# EAGLE design schematic (EAGLE 6.5.0)
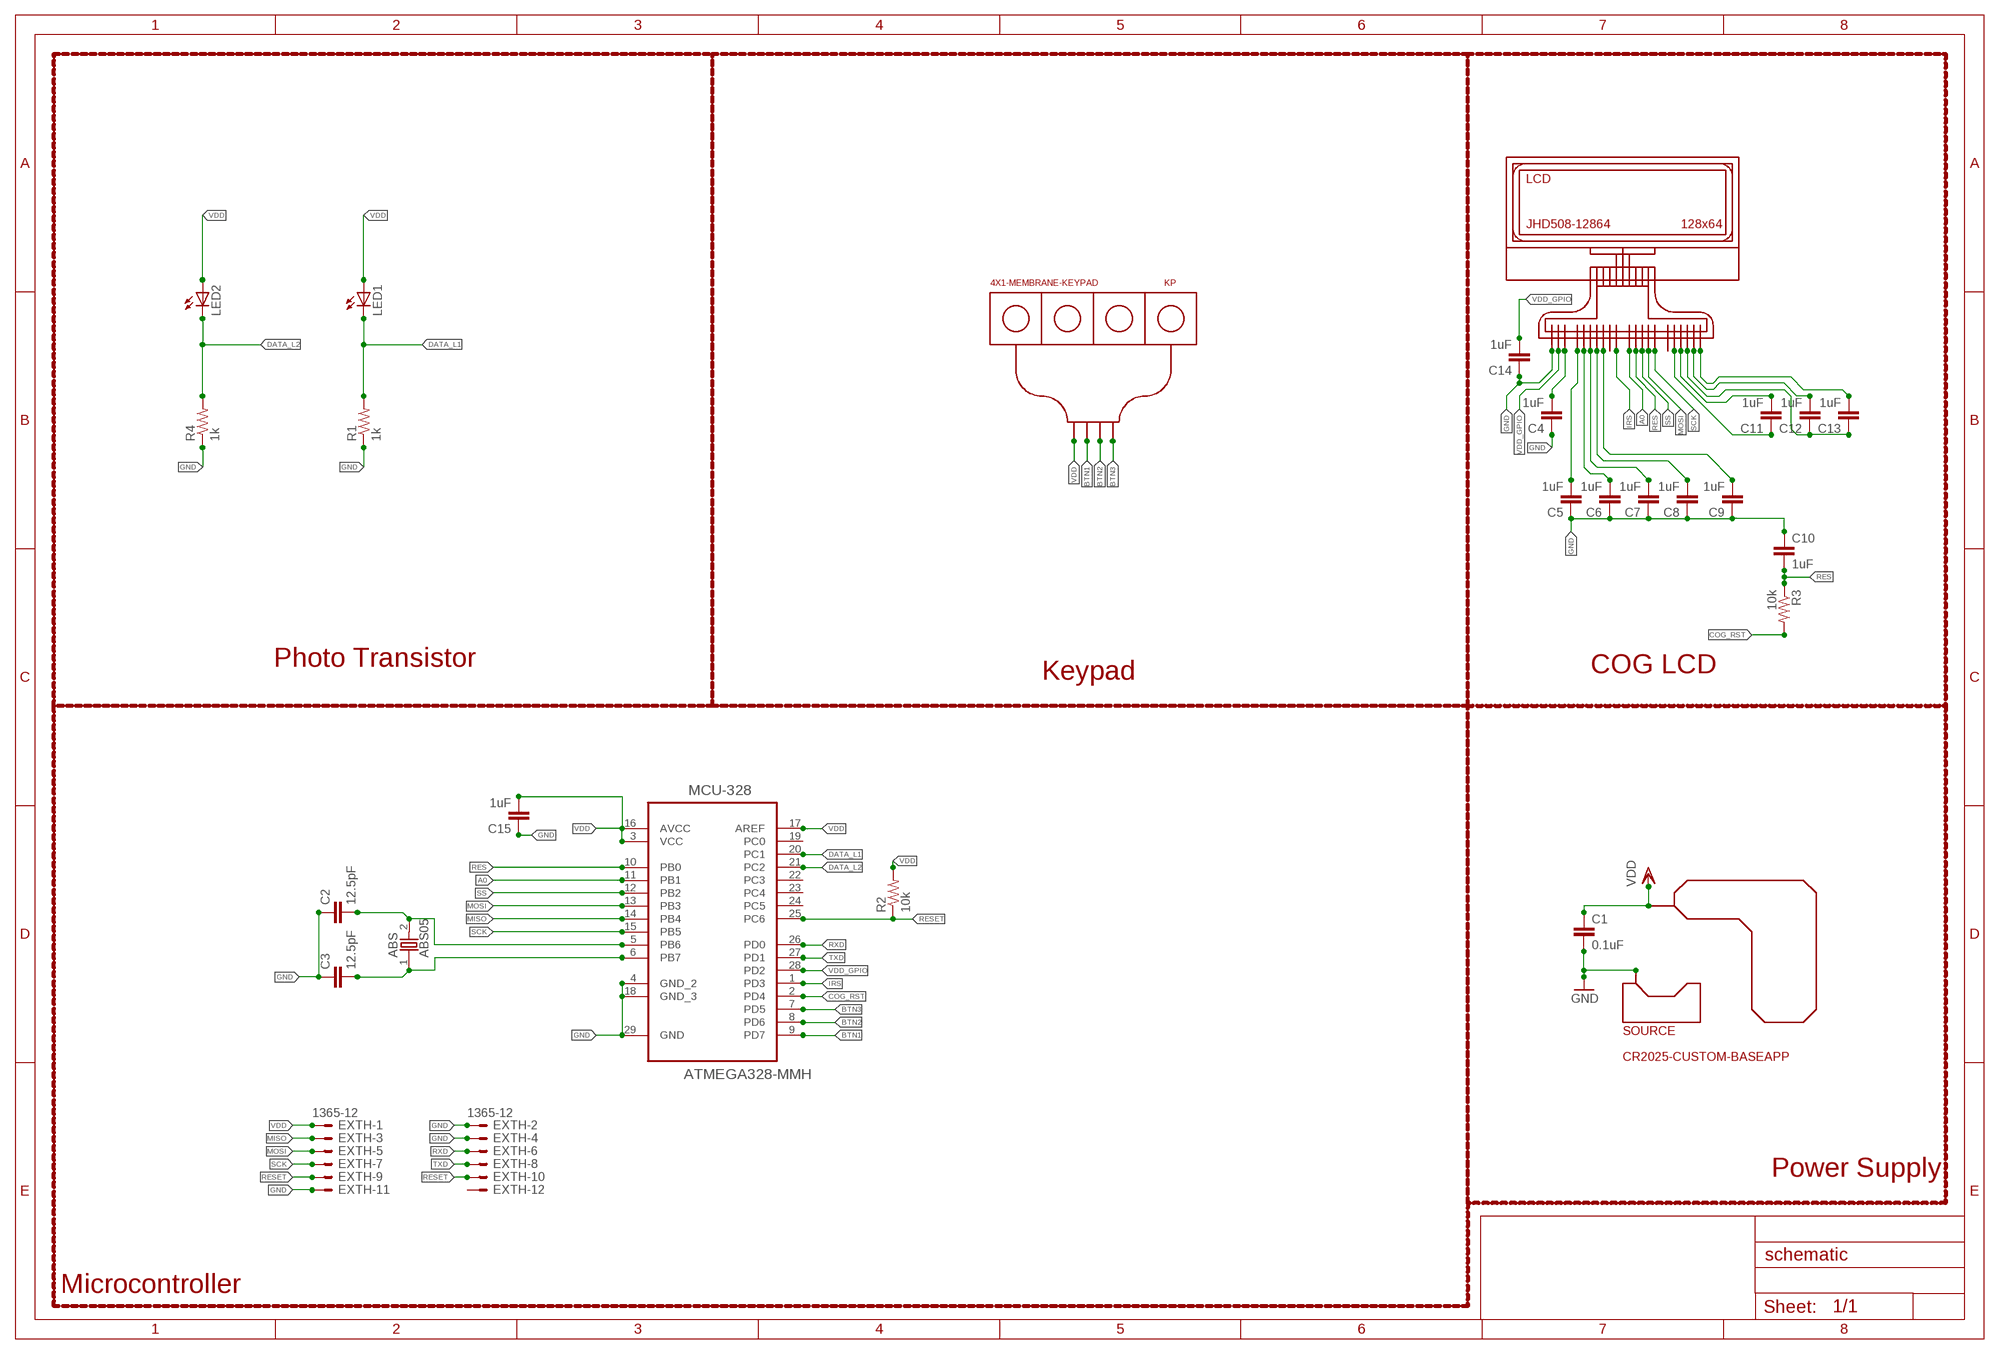
[diagram p0: schematic, sheet 1]

## Parts
ABS  ABS05  [ABS05]
C1  0.1uF  CAP0402-CAP  [0402-CAP]
C2  12.5pF  CAP0402-CAP  [0402-CAP]
C3  12.5pF  CAP0402-CAP  [0402-CAP]
C4  1uF  CAP0402-CAP  [0402-CAP]
C5  1uF  CAP0402-CAP  [0402-CAP]
C6  1uF  CAP0402-CAP  [0402-CAP]
C7  1uF  CAP0402-CAP  [0402-CAP]
C8  1uF  CAP0402-CAP  [0402-CAP]
C9  1uF  CAP0402-CAP  [0402-CAP]
C10  1uF  CAP0402-CAP  [0402-CAP]
C11  1uF  CAP0402-CAP  [0402-CAP]
C12  1uF  CAP0402-CAP  [0402-CAP]
C13  1uF  CAP0402-CAP  [0402-CAP]
C14  1uF  CAP0402-CAP  [0402-CAP]
C15  1uF  CAP0402-CAP  [0402-CAP]
EXTH  1365-12  [1365-12]
KP  4X1-MEMBRANE-KEYPAD  [4X1-MEMBRANE-KEYPAD]
LCD  JHD508-12864  [FSTN]
LED1  LEDCHIP-LED0805  [CHIP-LED0805]
LED2  LEDCHIP-LED0805  [CHIP-LED0805]
MCU-328  ATMEGA328-MMH  [QFN45P400X400X100-29N]
R1  1k  RESISTOR0402-RES  [0402-RES]
R2  10k  RESISTOR0402-RES  [0402-RES]
R3  10k  RESISTOR0402-RES  [0402-RES]
R4  1k  RESISTOR0402-RES  [0402-RES]
SOURCE  CR2025-CUSTOM-BASEAPP  [CR2025-CUSTOM-BASEAPP]

## Nets
A0: LCD.P$19(A0) MCU-328.11(PB1)
BTN1: KP.P$2 MCU-328.9(PD7)
BTN2: KP.P$3 MCU-328.8(PD6)
BTN3: KP.P$4 MCU-328.7(PD5)
COG_RST: MCU-328.2(PD4) R3.2
DATA_L1: LED1.C MCU-328.20(PC1) R1.2
DATA_L2: LED2.C MCU-328.21(PC2) R4.2
GND: C1.2 C2.1 C3.1 C4.1 C5.1 C6.1 C7.1 C8.1 C9.1 C10.1 C14.1 C15.1 EXTH.2 EXTH.4 EXTH.11 LCD.P$15(GND) MCU-328.4(GND_2) MCU-328.18(GND_3) MCU-328.29(GND) R1.1 R4.1 SOURCE.1(GND)
IRS: LCD.P$1(IRS) MCU-328.1(PD3)
MISO: EXTH.3 MCU-328.14(PB4)
MOSI: EXTH.5 LCD.P$17(SI) MCU-328.13(PB3)
N$1: C11.2 LCD.P$10(CAP2N)
N$2: ABS.2 C2.2 MCU-328.5(PB6)
N$3: C4.2 LCD.P$14(VOUT)
N$4: C5.2 LCD.P$7(V1)
N$5: ABS.1 C3.2 MCU-328.6(PB7)
N$7: C6.2 LCD.P$6(V2)
N$8: C7.2 LCD.P$5(V3)
N$9: C8.2 LCD.P$4(V4)
N$10: C9.2 LCD.P$3(V5)
N$11: C12.2 LCD.P$12(CAP1P)
N$12: C12.1 C13.1 LCD.P$11(CAP1N)
N$19: C11.1 LCD.P$9(CAP2P)
N$23: C13.2 LCD.P$13(CAP3N)
RES: C10.2 LCD.P$20(/RES) MCU-328.10(PB0) R3.1
RESET: EXTH.9 EXTH.10 MCU-328.25(PC6) R2.1
RXD: EXTH.6 MCU-328.26(PD0)
SCK: EXTH.7 LCD.P$18(SCL) MCU-328.15(PB5)
SS: LCD.P$21(/CS1) MCU-328.12(PB2)
TXD: EXTH.8 MCU-328.27(PD1)
VDD: C1.1 C15.2 EXTH.1 KP.P$1 LED1.A LED2.A MCU-328.3(VCC) MCU-328.16(AVCC) MCU-328.17(AREF) R2.2 SOURCE.2(VDD)
VDD_GPIO: C14.2 LCD.P$16(VDD) MCU-328.28(PD2)
Unconnected: EXTH.12 LCD.P$2(VR) LCD.P$8(CAP4N) MCU-328.19(PC0) MCU-328.22(PC3) MCU-328.23(PC4) MCU-328.24(PC5)

## Notes on the sheet
- Photo Transistor | COG LCD
- Keypad
- Power Supply
- Microcontroller

## Library data of the parts
ABS = baseOauth:ABS05
C1-C15 = SparkFun-Capacitors:CAP: Capacitor Standard 0603 ceramic capacitor, and 0.1" leaded capacitor.
EXTH = con-leotronics:1365-12: DUAL ROW STRAIGHT HEADER 1364 SERIES. 1.27mm x 1.27mm. Without Fixing Post. SMT Source: http://www.leotronics.co.uk/Conexcon/Data%20Sheets/sec.%20A/1364ing.pdf; OC_FARNELL: unknown; OC_NEWARK: unknown
KP = baseOauth:4X1-MEMBRANE-KEYPAD
LCD = baseOauth:JHD508-12864
LED1 LED2 = adafruit:LED: LED OSRAM: - CHIPLED LG R971, LG N971, LY N971, LG Q971, LY Q971, LO R971, LY R971 LH N974, LH R974 LS Q976, LO Q976, LY Q976 LO Q996 - Hyper CHIPLED LW Q18S LB Q993, LB Q99A, LB R99A - SideLED LS A670, LO A670, LY A670, LG A670, LP A670 LB A673, LV A673, LT A673, LW A673 LH A674 LY A675 LS A676, LA A676, LO A676, LY A676, LW A676 LS A679, LY A679, LG A679 - Hyper Micro SIDELED® LS Y876, LA Y876, LO Y876, LY Y876 LT Y87S - SmartLED LW L88C, LW L88S LB L89C, LB L89S, LG L890 LS L89K, LO L89K, LY L89K LS L896, LA L896, LO L896, LY L896 - TOPLED LS T670, LO T670, LY T670, LG T670, LP T670 LSG T670, LSP T670, LSY T670, LOP T670, LYG T670 LG T671, LOG T671, LSG T671 LB T673, LV T673, LT T673, LW T673 LH T674 LS T676, LA T676, LO T676, LY T676, LB T676, LH T676, LSB T676, LW T676 LB T67C, LV T67C, LT T67C, LS T67K, LO T67K, LY T67K, LW E67C LS E67B, LA E67B, LO E67B, LY E67B, LB E67C, LV E67C, LT E67C LW T67C LS T679, LY T679, LG T679 LS T770, LO T770, LY T770, LG T770, LP T770 LB T773, LV T773, LT T773, LW T773 LH T774 LS E675, LA E675, LY E675, LS T675 LS T776, LA T776, LO T776, LY T776, LB T776 LHGB T686 LT T68C, LB T68C - Hyper Mini TOPLED® LB M676 - Mini TOPLED Santana® LG M470 LS M47K, LO M47K, LY M47K Source: http://www.osram.convergy.de/
MCU-328 = baseOauth:ATMEGA328-MMH: MCU, 8BIT, AVR, MODL,QFN-28; MPN: ATMEGA328-MMH; OC_FARNELL: 2066293; OC_NEWARK: Unknown; PACKAGE: QFN-28; SUPPLIER: ATMEL
R1-R4 = SparkFun-Passives:RESISTOR: Resistor Basic schematic elements and footprints for 0603, 1206, and PTH resistors.
SOURCE = baseOauth:CR2025-CUSTOM-BASEAPP

## Net classes
0 default: width 0.203 mm, drill 0.305 mm, clearance 0.152 mm

## Board
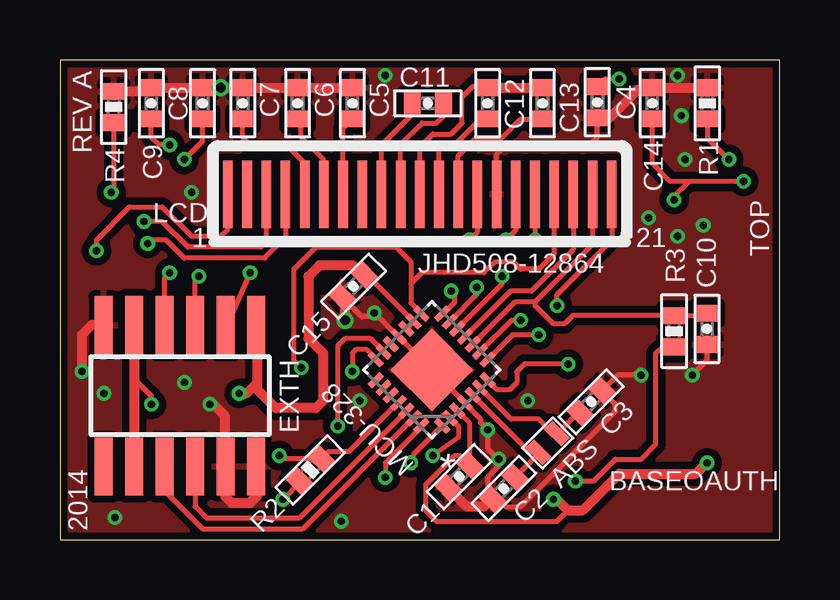
[diagram p1: board, top side]
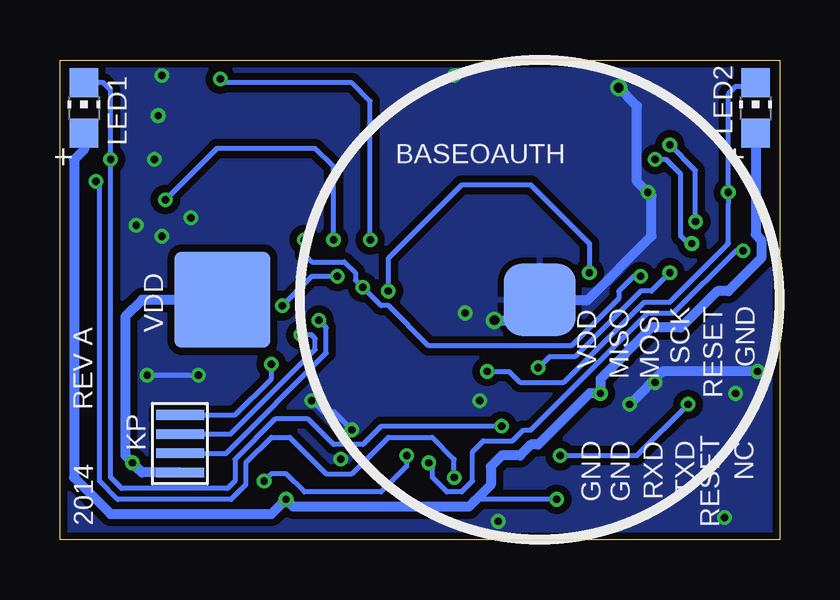
[diagram p2: board, bottom side, seen from below]

Size 30 x 20 mm. Coordinates in mm from the lower left corner, seen from the top.
Outline: 0,0 30,0 30,20 0,20 0,0
Copper layers (1*16): Top 0.035mm / dielectric 1.5mm / Bottom 0.035mm
Design rules "ITEADstudio_DRC": minimum track width 6mil, minimum drill 12mil, track to track 6mil, track to pad 6mil, pad to pad 6mil, via to via 6mil, smd to smd 0mil, copper to edge 10mil, drill to drill 10mil, minimum pad ring 10mil, minimum via ring 6mil, stop-mask expansion 2mil, vias tented up to drill 100mil, thermal gap 10mil

### Footprints (pad centres in the part's own frame; a part is rotated, then mirrored left to right if it is on the bottom)
ABS05 = smd 0.508 x 1.016: 1 -0.55,0; 2 0.55,0
0402-CAP = smd 0.7 x 0.9: 1 -0.65,0; 2 0.65,0
1365-12 = smd 0.76 x 2.4: 1 -3.175,-2.95; 2 -3.175,2.95; 3 -1.905,-2.95; 4 -1.905,2.95; 5 -0.635,-2.95; 6 -0.635,2.95; 7 0.635,-2.95; 8 0.635,2.95; 9 1.905,-2.95; 10 1.905,2.95; 11 3.175,-2.95; 12 3.175,2.95
4X1-MEMBRANE-KEYPAD = smd 0.4 x 2: P$1 -1.2,0; P$2 -0.4,0; P$3 0.4,0; P$4 1.2,0
FSTN = smd 0.4 x 2.8: P$1 -8,1.4; P$2 -7.2,1.4; P$3 -6.4,1.4; P$4 -5.6,1.4; P$5 -4.8,1.4; P$6 -4,1.4; P$7 -3.2,1.4; P$8 -2.4,1.4; P$9 -1.6,1.4; P$10 -0.8,1.4; P$11 0,1.4; P$12 0.8,1.4; P$13 1.6,1.4; P$14 2.4,1.4; P$15 3.2,1.4; P$16 4,1.4; P$17 4.8,1.4; P$18 5.6,1.4; P$19 6.4,1.4; P$20 7.2,1.4; P$21 8,1.4
CHIP-LED0805 = smd 1.2 x 1.2: A 0,-1.05; C 0,1.05
QFN45P400X400X100-29N = smd 0.711 x 0.254: 1 -1.956,1.346; 2 -1.956,0.889; 3 -1.956,0.457; 4 -1.956,0; 5 -1.956,-0.457; 6 -1.956,-0.889; 7 -1.956,-1.346; 15 1.956,-1.346; 16 1.956,-0.889; 17 1.956,-0.457; 18 1.956,0; 19 1.956,0.457; 20 1.956,0.889; 21 1.956,1.346 | smd 0.254 x 0.711: 8 -1.346,-1.956; 9 -0.889,-1.956; 10 -0.457,-1.956; 11 0,-1.956; 12 0.457,-1.956; 13 0.889,-1.956; 14 1.346,-1.956; 22 1.346,1.956; 23 0.889,1.956; 24 0.457,1.956; 25 0,1.956; 26 -0.457,1.956; 27 -0.889,1.956; 28 -1.346,1.956 | smd 2.438 x 2.438: 29 0,0
0402-RES = smd 0.7 x 0.9: 1 -0.65,0; 2 0.65,0
CR2025-CUSTOM-BASEAPP = smd 3 x 3: 1 0,0 | smd 4 x 4: 2 13.224,0

### Placement (x,y rotation side)
ABS  20.33,4.03 225 top
C1  16.64,2.63 225 top
C2  18.5,2.13 45 top
C3  22.14,5.75 225 top
C4  22.4,18.23 90 top
C5  12.19,18.19 270 top
C6  9.91,18.19 270 top
C7  7.62,18.19 270 top
C8  5.94,18.19 270 top
C9  3.81,18.19 270 top
C10  26.97,8.78 90 top
C11  15.34,18.19 0 top
C12  17.83,18.19 270 top
C13  20.12,18.19 270 top
C14  24.69,18.19 270 top
C15  12.24,10.56 45 top
EXTH  5,6 180 top
KP  25,4 90 bottom
LCD  15,13 0 top
LED1  29,18 0 bottom
LED2  1,18 0 bottom
MCU-328  15.5,7.08 135 top
R1  26.99,18.19 270 top
R2  10.44,2.9 225 top
R3  25.6,8.69 270 top
R4  2.24,18.04 270 top
SOURCE  10,10 180 bottom

### Tracks (layer width: path | path; a pad name or v marks a point on that pad's centre or on a via)
A0
  Top 0.203: LCD.P$19 21.4,12.1 19.66,10.36 18.78,10.36 MCU-328.11
BTN1  (via drill 0.3)
  Top 0.203: v19.2,9.14 18.82,9.14 MCU-328.9
  Bottom 0.203: KP.P$2 23.07,3.6 18.9,7.77 18.9,8.84 v19.2,9.14
BTN2  (via drill 0.3)
  Top 0.203: v19.96,8.53 18.86,8.53 MCU-328.8
  Bottom 0.203: KP.P$3 22.88,4.4 19.36,7.92 19.36,8.38 19.51,8.53 v19.96,8.53
BTN3  (via drill 0.3)
  Top 0.203: v21.18,7.32 19.36,7.32 19.05,7.01 19.05,6.55 18.75,6.25 18.24,6.25 MCU-328.7
  Bottom 0.203: KP.P$4 22.69,5.2 21.18,6.71 v21.18,7.32
COG_RST  (via drill 0.3)
  Top 0.203: MCU-328.2 16.27,5.07 16.61,4.72 16.61,4.27 v15.54,3.5 | v21.49,2.44 22.25,2.44 23.16,3.35 24.23,3.35 24.84,3.96 24.84,7.77 25.15,8.08 25.56,8.08 R3.2
  Bottom 0.203: v21.49,2.44 21.18,2.74 20.57,2.74 19.81,1.98 16.61,1.98 15.54,3.05 v15.54,3.5
DATA_L1  (via drill 0.3)
  Top 0.203: MCU-328.20 12.95,8.38 11.89,8.38 11.58,8.08 v11.58,4.72 | R1.2 26.99,16.75 v27.89,15.85
  Bottom 0.203: LED1.C 28.19,19.05 27.89,18.75 v27.89,15.85 27.89,2.59 27.43,2.13 23.01,2.13 22.71,2.44 22.71,3.35 21.03,5.03 19.66,5.03 18.59,3.96 17.37,3.96 16.61,4.72 v11.58,4.72
DATA_L2  (via drill 0.3)
  Top 0.203: MCU-328.21 13.16,7.56 12.8,7.92 12.34,7.92 12.19,7.77 v12.19,7.01 | R4.2 2.24,14.58 v2.13,14.48
  Bottom 0.203: v12.19,7.01 11.28,7.01 10.82,6.55 8.99,6.55 5.64,9.91 4.57,9.91 2.13,12.34 2.13,14.02 v2.13,14.48 2.13,18.59 1.83,18.9 1.15,18.9 LED2.C
GND  (via drill 0.3, 0.41)
  Top 0.203: LCD.P$15 18.2,16.07 18.44,16.31 21.95,16.31 22.4,16.76 C4.1 | MCU-328.18 14.09,8.46 13.26,9.3 12.58,9.3 C15.1 | C10.1 26.98,7.47 v26.36,6.86 | v24.23,6.86 23.25,6.86 C3.1 23.16,5.64 23.16,5.33 19.2,1.37 18.59,1.37 18.29,1.67 C2.1 17.83,1.89 17.83,2.59 18.29,3.05 v18.29,3.35 17.83,3.81 v17.83,4.57 17.53,4.88 17.53,5.03 16.88,5.67 MCU-328.4 MCU-328.29 | MCU-328.18 | MCU-328.18 MCU-328.29 | MCU-328.29
  Top 0.406: R4.1 3.66,18.69 C9.1 C8.1 v6.71,18.84 C7.1 C6.1 C5.1 | EXTH.2 8.23,3 8.23,1.83 7.92,1.52 7.16,1.52 6.91,1.78 EXTH.4 6.86,3.1 6.86,5.18 6.4,5.64 v6.25,5.64 | C2.1 17.98,1.67 17.68,1.37 16.98,1.37 C1.2 | C4.1 22.92,17.58 24.08,18.75 24.59,18.75 C14.1 R1.1 | EXTH.11 1.33,8.95 0.91,8.53 v0.91,7.01 | C15.1 11.89,10.1 v11.89,9.14
  Bottom 0.203: v19.51,5.79 19.05,5.33 18.59,5.33 v17.83,4.57 | v26.36,6.86 v24.23,6.86
  Bottom 0.406: v0.91,7.01 4.88,7.01 v6.25,5.64 | v11.89,9.14 10,9.14 SOURCE.1 7.98,10 5.33,12.65 5.33,14.33 v5.49,14.48 5.94,14.94 5.94,18.08 v6.71,18.84
  other vias: 26.82,13.11 2.29,0.91 1.83,6.1 5.18,6.55 12.5,5.79 11.73,0.76 13.11,9.45 13.56,19.35 25.76,19.35 24.54,13.41 25.76,12.65 26.06,15.85 25.91,17.68
  pour Top (isolate 0.305): -1.37,20.73 30.78,20.73 30.78,-0.61 -1.37,-0.61
  pour Bottom (isolate 0.305): -0.61,20.27 30.33,20.27 30.33,-0.3 -0.61,-0.3
IRS  (via drill 0.3)
  Top 0.203: MCU-328.1 15.98,4.75 | v1.52,12.04 1.52,12.5 2.9,13.87 4.27,13.87 5.49,12.65 6.71,12.65 7.01,12.95 LCD.P$1 | MCU-328.1 15.87,4.75 | v14.63,3.2 14.78,3.6 MCU-328.1
  Bottom 0.203: v1.52,12.04 1.83,12.04 4.42,9.45 5.49,9.45 10.36,4.57 10.67,4.57 11.12,4.12 12.34,4.12 12.8,3.66 12.8,2.44 13.26,1.98 13.87,1.98 14.48,2.59 14.48,3.05 v14.63,3.2
MISO  (via drill 0.3)
  Top 0.203: MCU-328.14 15.97,9.42 16.46,9.91 16.46,10.21 v16.31,10.36 | v7.92,11.12 7.01,9.05 EXTH.3
  Bottom 0.203: v16.31,10.36 16.31,11.73 13.26,14.78 10.36,14.78 7.92,12.34 v7.92,11.12
MOSI  (via drill 0.3)
  Top 0.203: LCD.P$17 v19.8,12.51 v19.81,12.5 | v17.37,10.52 17.37,10.21 MCU-328.13 | EXTH.5 5.63,10.82 v5.79,10.97
  Bottom 0.203: v19.81,12.5 19.81,11.89 19.51,11.58 18.14,11.58 17.68,11.12 17.68,10.82 v17.37,10.52 16.61,9.75 16.31,9.75 14.63,8.08 8.69,8.08 6.71,10.06 6.71,10.36 6.1,10.97 v5.79,10.97
N$1
  Top 0.203: LCD.P$10 14.2,16.49 15.09,17.37 15.7,17.37 16,17.68 16,18.18 C11.2
N$2
  Top 0.203: MCU-328.5 19.59,3.64 ABS.2 19.94,3.57 C2.2
N$3  (via drill 0.3)
  Top 0.203: LCD.P$14 17.4,12.83 v17.07,12.5 | v23.32,19.2 22.72,19.2 C4.2
  Bottom 0.203: v17.07,12.5 17.07,18.29 17.83,19.05 23.16,19.05 v23.32,19.2
N$4
  Top 0.203: LCD.P$7 11.8,17.15 C5.2
N$5
  Top 0.203: MCU-328.6 18.81,5.03 19.96,5.03 20.58,4.41 ABS.1 21.59,5.29 C3.2
N$7
  Top 0.203: LCD.P$6 11,15.82 10.06,16.76 10.06,17.39 C6.2
N$8
  Top 0.203: LCD.P$5 10.2,15.71 9.6,16.31 8.08,16.31 7.62,16.76 C7.2
N$9  (via drill 0.3)
  Top 0.203: LCD.P$4 9.4,12.6 8.53,11.73 5.18,11.73 4.42,12.5 3.81,12.5 v3.66,12.34 | v5.18,15.85 5.94,16.61 C8.2
  Bottom 0.203: v3.66,12.34 3.81,12.34 4.12,12.65 4.12,15.24 4.72,15.85 v5.18,15.85
N$10  (via drill 0.3)
  Top 0.203: LCD.P$3 8.6,12.41 8.38,12.19 5.33,12.19 4.27,13.26 v3.5,13.26 | v4.57,16.46 4.12,16.46 3.81,16.76 C9.2
  Bottom 0.203: v3.5,13.26 3.5,15.39 v4.57,16.46
N$11
  Top 0.203: LCD.P$12 15.8,16.26 16,16.46 16.46,16.46 17.37,17.37 17.66,17.37 C12.2
N$12
  Top 0.203: LCD.P$11 15,16.37 15.54,16.92 16.31,16.92 16.76,17.37 16.76,18.44 17.22,18.9 17.77,18.9 C12.1
  Top 0.406: C12.1 C13.1
N$19
  Top 0.203: LCD.P$9 13.4,16.45 14.63,17.68 14.63,18.13 C11.1
N$23
  Top 0.203: LCD.P$13 16.6,15.99 17.37,16.76 18.44,16.76 19.2,17.53 20.1,17.53 C13.2
RES
  Top 0.203: LCD.P$20 22.2,12.29 19.81,9.91 | 19.81,9.91 18.97,9.91 MCU-328.10 | C10.2 26.88,9.34 R3.1 21.38,9.34 21.03,8.99 20.57,8.99 19.81,9.75 19.81,9.91
RESET  (via drill 0.3)
  Top 0.203: MCU-328.25 14.08,5.7 12.04,3.66 11.19,3.66 R2.1 9.29,3.36 v9.14,3.5 | v3.81,5.64 3.81,5.99 3.1,6.71
  Top 0.406: EXTH.9 3.1,6.71 EXTH.10
  Bottom 0.203: v9.14,3.5 5.94,3.5 v3.81,5.64
RXD
  Top 0.203: EXTH.6 5.63,1.38 6.1,0.91 9.98,0.91 MCU-328.26
SCK  (via drill 0.3)
  Top 0.203: LCD.P$18 20.6,11.91 19.96,11.28 19.2,11.28 18.9,11.58 18.14,11.58 17.68,11.12 15.09,11.12 14.63,10.67 | 14.63,10.67 14.63,9.86 MCU-328.15 | EXTH.7 4.37,10.92 v4.57,11.12 | v10.06,7.16 9.75,7.47 9.75,11.28 10.67,12.19 14.02,12.19 14.63,11.58 14.63,10.67
  Bottom 0.203: v4.57,11.12 5.33,10.36 5.79,10.36 8.53,7.62 9.6,7.62 v10.06,7.16
SS  (via drill 0.3)
  Top 0.203: LCD.P$21 23,12.48 20.73,10.21 v20.73,9.75 | MCU-328.12 18.44,10.67 v18.44,10.97
  Bottom 0.203: v18.44,10.97 19.51,10.97 v20.73,9.75
TXD
  Top 0.203: EXTH.8 4.37,2.04 5.94,0.46 10.13,0.46 MCU-328.27
VDD  (via drill 0.3)
  Top 0.203: C15.2 12.82,11.02 MCU-328.16 MCU-328.17 | MCU-328.3 16.57,5.38 17.07,4.88 17.07,3.12 C1.1 16.68,3.5 16.46,3.5 15.24,2.29 15.24,1.22 15.7,0.76 20.73,0.76 21.18,1.22 | R2.2 9.98,2.36 v9.3,1.68
  Top 0.406: C15.2 12.6,11.02 12.19,11.43 10.82,11.43 10.36,10.97 10.36,8.38 10.97,7.77 10.97,5.79 10.67,5.49 8.99,5.49 8.23,6.25 8.23,6.55 | 8.23,6.55 8.23,8.89 EXTH.1 | v7.47,6.1 7.77,6.1 8.23,6.55 | v26.98,3.2 26.52,2.74 23.32,2.74 21.79,1.22 21.18,1.22 20.73,1.68 v20.57,1.68
  Bottom 0.203: v9.3,1.68 12.65,1.68 12.72,1.6
  Bottom 0.406: LED2.A 1,12.73 0.76,12.5 0.76,11.73 2.13,10.36 2.59,10.36 4.12,8.84 5.33,8.84 7.47,6.71 v7.47,6.1 7.92,6.1 10.06,3.96 10.36,3.96 10.82,3.5 11.58,3.5 12.04,3.05 12.04,2.29 12.72,1.6 12.95,1.37 20.27,1.37 v20.57,1.68 21.18,1.07 27.89,1.07 29.41,2.59 29.41,15.85 29,16.26 LED1.A | v26.98,3.2 26.67,2.9 | KP.P$1 26.57,2.8 v26.98,3.2 | SOURCE.2 26.58,10 27.28,9.3 27.28,3.5 v26.98,3.2
VDD_GPIO  (via drill 0.3)
  Top 0.203: MCU-328.28 15.07,4.71 13.56,3.2 v13.56,2.59 | v28.5,14.94 26.21,14.94 | 26.21,14.94 25.45,14.94 24.69,15.7 C14.2 | LCD.P$16 19,12.9 v18.59,12.5 | v25.6,14.17 25.6,14.33 26.21,14.94
  Bottom 0.203: v13.56,2.59 13.56,3.35 14.48,4.27 16.31,4.27 17.83,2.74 18.9,2.74 20.42,4.27 21.18,4.27 22.25,3.2 22.25,2.29 22.86,1.68 27.58,1.68 28.35,2.44 28.35,14.78 v28.5,14.94 | v18.59,12.5 18.59,15.54 19.36,16.31 23.47,16.31 v25.6,14.17

### Text on the board
tPlace: REV A | TOP | BASEOAUTH | 2014
bPlace: BASEOAUTH | VDD | GND | RESET | SCK | MOSI | MISO | VDD | REV A | NC | RESET | TXD | RXD | GND | GND | 2014